# Altium schematic sheet Sheet2.SchDoc: TERMINATION RESISTORS
size B; DocumentNumber: 2; SheetNumber: 2; SheetTotal: 5
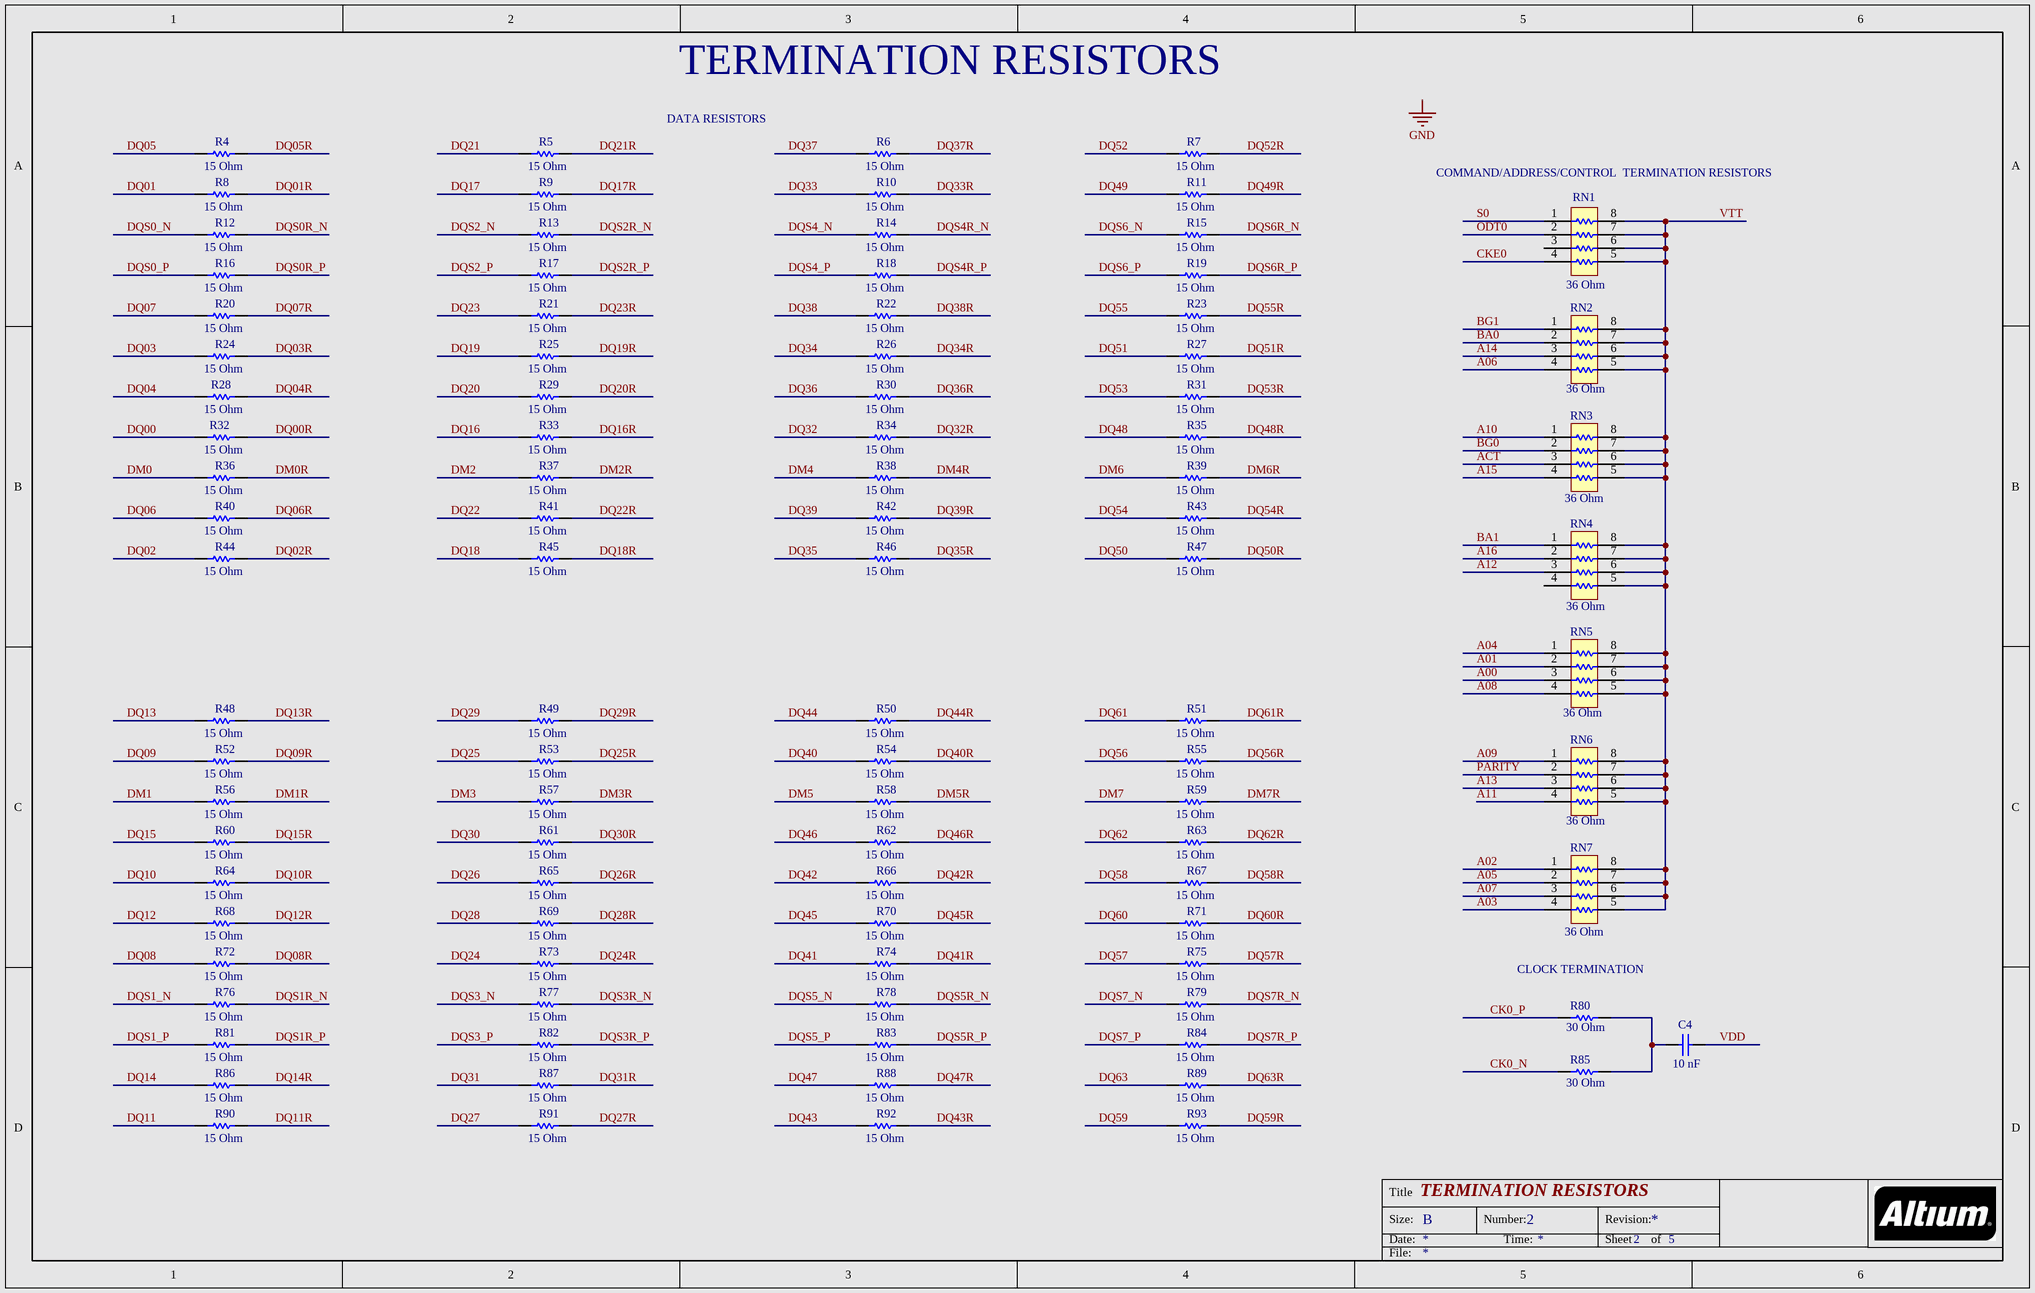
[diagram p0: Sheet2.SchDoc]

## Parts
C4  Capacitance: 10 nF  [CAPC1005X55X10NL05]  (hidden comment: C1005X7R1E103M050BB)
R4  Resistance: 15 Ohm  [RESC0603X26X15ML03T05]  (hidden comment: ERJ-1GEJ150C)
R5  Resistance: 15 Ohm  [RESC0603X26X15ML03T05]  (hidden comment: ERJ-1GEJ150C)
R6  Resistance: 15 Ohm  [RESC0603X26X15ML03T05]  (hidden comment: ERJ-1GEJ150C)
R7  Resistance: 15 Ohm  [RESC0603X26X15ML03T05]  (hidden comment: ERJ-1GEJ150C)
R8  Resistance: 15 Ohm  [RESC0603X26X15ML03T05]  (hidden comment: ERJ-1GEJ150C)
R9  Resistance: 15 Ohm  [RESC0603X26X15ML03T05]  (hidden comment: ERJ-1GEJ150C)
R10  Resistance: 15 Ohm  [RESC0603X26X15ML03T05]  (hidden comment: ERJ-1GEJ150C)
R11  Resistance: 15 Ohm  [RESC0603X26X15ML03T05]  (hidden comment: ERJ-1GEJ150C)
R12  Resistance: 15 Ohm  [RESC0603X26X15ML03T05]  (hidden comment: ERJ-1GEJ150C)
R13  Resistance: 15 Ohm  [RESC0603X26X15ML03T05]  (hidden comment: ERJ-1GEJ150C)
R14  Resistance: 15 Ohm  [RESC0603X26X15ML03T05]  (hidden comment: ERJ-1GEJ150C)
R15  Resistance: 15 Ohm  [RESC0603X26X15ML03T05]  (hidden comment: ERJ-1GEJ150C)
R16  Resistance: 15 Ohm  [RESC0603X26X15ML03T05]  (hidden comment: ERJ-1GEJ150C)
R17  Resistance: 15 Ohm  [RESC0603X26X15ML03T05]  (hidden comment: ERJ-1GEJ150C)
R18  Resistance: 15 Ohm  [RESC0603X26X15ML03T05]  (hidden comment: ERJ-1GEJ150C)
R19  Resistance: 15 Ohm  [RESC0603X26X15ML03T05]  (hidden comment: ERJ-1GEJ150C)
R20  Resistance: 15 Ohm  [RESC0603X26X15ML03T05]  (hidden comment: ERJ-1GEJ150C)
R21  Resistance: 15 Ohm  [RESC0603X26X15ML03T05]  (hidden comment: ERJ-1GEJ150C)
R22  Resistance: 15 Ohm  [RESC0603X26X15ML03T05]  (hidden comment: ERJ-1GEJ150C)
R23  Resistance: 15 Ohm  [RESC0603X26X15ML03T05]  (hidden comment: ERJ-1GEJ150C)
R24  Resistance: 15 Ohm  [RESC0603X26X15ML03T05]  (hidden comment: ERJ-1GEJ150C)
R25  Resistance: 15 Ohm  [RESC0603X26X15ML03T05]  (hidden comment: ERJ-1GEJ150C)
R26  Resistance: 15 Ohm  [RESC0603X26X15ML03T05]  (hidden comment: ERJ-1GEJ150C)
R27  Resistance: 15 Ohm  [RESC0603X26X15ML03T05]  (hidden comment: ERJ-1GEJ150C)
R28  Resistance: 15 Ohm  [RESC0603X26X15ML03T05]  (hidden comment: ERJ-1GEJ150C)
R29  Resistance: 15 Ohm  [RESC0603X26X15ML03T05]  (hidden comment: ERJ-1GEJ150C)
R30  Resistance: 15 Ohm  [RESC0603X26X15ML03T05]  (hidden comment: ERJ-1GEJ150C)
R31  Resistance: 15 Ohm  [RESC0603X26X15ML03T05]  (hidden comment: ERJ-1GEJ150C)
R32  Resistance: 15 Ohm  [RESC0603X26X15ML03T05]  (hidden comment: ERJ-1GEJ150C)
R33  Resistance: 15 Ohm  [RESC0603X26X15ML03T05]  (hidden comment: ERJ-1GEJ150C)
R34  Resistance: 15 Ohm  [RESC0603X26X15ML03T05]  (hidden comment: ERJ-1GEJ150C)
R35  Resistance: 15 Ohm  [RESC0603X26X15ML03T05]  (hidden comment: ERJ-1GEJ150C)
R36  Resistance: 15 Ohm  [RESC0603X26X15ML03T05]  (hidden comment: ERJ-1GEJ150C)
R37  Resistance: 15 Ohm  [RESC0603X26X15ML03T05]  (hidden comment: ERJ-1GEJ150C)
R38  Resistance: 15 Ohm  [RESC0603X26X15ML03T05]  (hidden comment: ERJ-1GEJ150C)
R39  Resistance: 15 Ohm  [RESC0603X26X15ML03T05]  (hidden comment: ERJ-1GEJ150C)
R40  Resistance: 15 Ohm  [RESC0603X26X15ML03T05]  (hidden comment: ERJ-1GEJ150C)
R41  Resistance: 15 Ohm  [RESC0603X26X15ML03T05]  (hidden comment: ERJ-1GEJ150C)
R42  Resistance: 15 Ohm  [RESC0603X26X15ML03T05]  (hidden comment: ERJ-1GEJ150C)
R43  Resistance: 15 Ohm  [RESC0603X26X15ML03T05]  (hidden comment: ERJ-1GEJ150C)
R44  Resistance: 15 Ohm  [RESC0603X26X15ML03T05]  (hidden comment: ERJ-1GEJ150C)
R45  Resistance: 15 Ohm  [RESC0603X26X15ML03T05]  (hidden comment: ERJ-1GEJ150C)
R46  Resistance: 15 Ohm  [RESC0603X26X15ML03T05]  (hidden comment: ERJ-1GEJ150C)
R47  Resistance: 15 Ohm  [RESC0603X26X15ML03T05]  (hidden comment: ERJ-1GEJ150C)
R48  Resistance: 15 Ohm  [RESC0603X26X15ML03T05]  (hidden comment: ERJ-1GEJ150C)
R49  Resistance: 15 Ohm  [RESC0603X26X15ML03T05]  (hidden comment: ERJ-1GEJ150C)
R50  Resistance: 15 Ohm  [RESC0603X26X15ML03T05]  (hidden comment: ERJ-1GEJ150C)
R51  Resistance: 15 Ohm  [RESC0603X26X15ML03T05]  (hidden comment: ERJ-1GEJ150C)
R52  Resistance: 15 Ohm  [RESC0603X26X15ML03T05]  (hidden comment: ERJ-1GEJ150C)
R53  Resistance: 15 Ohm  [RESC0603X26X15ML03T05]  (hidden comment: ERJ-1GEJ150C)
R54  Resistance: 15 Ohm  [RESC0603X26X15ML03T05]  (hidden comment: ERJ-1GEJ150C)
R55  Resistance: 15 Ohm  [RESC0603X26X15ML03T05]  (hidden comment: ERJ-1GEJ150C)
R56  Resistance: 15 Ohm  [RESC0603X26X15ML03T05]  (hidden comment: ERJ-1GEJ150C)
R57  Resistance: 15 Ohm  [RESC0603X26X15ML03T05]  (hidden comment: ERJ-1GEJ150C)
R58  Resistance: 15 Ohm  [RESC0603X26X15ML03T05]  (hidden comment: ERJ-1GEJ150C)
R59  Resistance: 15 Ohm  [RESC0603X26X15ML03T05]  (hidden comment: ERJ-1GEJ150C)
R60  Resistance: 15 Ohm  [RESC0603X26X15ML03T05]  (hidden comment: ERJ-1GEJ150C)
R61  Resistance: 15 Ohm  [RESC0603X26X15ML03T05]  (hidden comment: ERJ-1GEJ150C)
R62  Resistance: 15 Ohm  [RESC0603X26X15ML03T05]  (hidden comment: ERJ-1GEJ150C)
R63  Resistance: 15 Ohm  [RESC0603X26X15ML03T05]  (hidden comment: ERJ-1GEJ150C)
R64  Resistance: 15 Ohm  [RESC0603X26X15ML03T05]  (hidden comment: ERJ-1GEJ150C)
R65  Resistance: 15 Ohm  [RESC0603X26X15ML03T05]  (hidden comment: ERJ-1GEJ150C)
R66  Resistance: 15 Ohm  [RESC0603X26X15ML03T05]  (hidden comment: ERJ-1GEJ150C)
R67  Resistance: 15 Ohm  [RESC0603X26X15ML03T05]  (hidden comment: ERJ-1GEJ150C)
R68  Resistance: 15 Ohm  [RESC0603X26X15ML03T05]  (hidden comment: ERJ-1GEJ150C)
R69  Resistance: 15 Ohm  [RESC0603X26X15ML03T05]  (hidden comment: ERJ-1GEJ150C)
R70  Resistance: 15 Ohm  [RESC0603X26X15ML03T05]  (hidden comment: ERJ-1GEJ150C)
R71  Resistance: 15 Ohm  [RESC0603X26X15ML03T05]  (hidden comment: ERJ-1GEJ150C)
R72  Resistance: 15 Ohm  [RESC0603X26X15ML03T05]  (hidden comment: ERJ-1GEJ150C)
R73  Resistance: 15 Ohm  [RESC0603X26X15ML03T05]  (hidden comment: ERJ-1GEJ150C)
R74  Resistance: 15 Ohm  [RESC0603X26X15ML03T05]  (hidden comment: ERJ-1GEJ150C)
R75  Resistance: 15 Ohm  [RESC0603X26X15ML03T05]  (hidden comment: ERJ-1GEJ150C)
R76  Resistance: 15 Ohm  [RESC0603X26X15ML03T05]  (hidden comment: ERJ-1GEJ150C)
R77  Resistance: 15 Ohm  [RESC0603X26X15ML03T05]  (hidden comment: ERJ-1GEJ150C)
R78  Resistance: 15 Ohm  [RESC0603X26X15ML03T05]  (hidden comment: ERJ-1GEJ150C)
R79  Resistance: 15 Ohm  [RESC0603X26X15ML03T05]  (hidden comment: ERJ-1GEJ150C)
R80  Resistance: 30 Ohm  [RESC1005X40X25NL5T10]  (hidden comment: RC0402JR-0730RL)
R81  Resistance: 15 Ohm  [RESC0603X26X15ML03T05]  (hidden comment: ERJ-1GEJ150C)
R82  Resistance: 15 Ohm  [RESC0603X26X15ML03T05]  (hidden comment: ERJ-1GEJ150C)
R83  Resistance: 15 Ohm  [RESC0603X26X15ML03T05]  (hidden comment: ERJ-1GEJ150C)
R84  Resistance: 15 Ohm  [RESC0603X26X15ML03T05]  (hidden comment: ERJ-1GEJ150C)
R85  Resistance: 30 Ohm  [RESC1005X40X25NL5T10]  (hidden comment: RC0402JR-0730RL)
R86  Resistance: 15 Ohm  [RESC0603X26X15ML03T05]  (hidden comment: ERJ-1GEJ150C)
R87  Resistance: 15 Ohm  [RESC0603X26X15ML03T05]  (hidden comment: ERJ-1GEJ150C)
R88  Resistance: 15 Ohm  [RESC0603X26X15ML03T05]  (hidden comment: ERJ-1GEJ150C)
R89  Resistance: 15 Ohm  [RESC0603X26X15ML03T05]  (hidden comment: ERJ-1GEJ150C)
R90  Resistance: 15 Ohm  [RESC0603X26X15ML03T05]  (hidden comment: ERJ-1GEJ150C)
R91  Resistance: 15 Ohm  [RESC0603X26X15ML03T05]  (hidden comment: ERJ-1GEJ150C)
R92  Resistance: 15 Ohm  [RESC0603X26X15ML03T05]  (hidden comment: ERJ-1GEJ150C)
R93  Resistance: 15 Ohm  [RESC0603X26X15ML03T05]  (hidden comment: ERJ-1GEJ150C)
RN1  Resistance: 36 Ohm  [BOUR-CAY10-J4_V]  (hidden comment: CAY10-360J4LF)
RN2  Resistance: 36 Ohm  [BOUR-CAY10-J4_V]  (hidden comment: CAY10-360J4LF)
RN3  Resistance: 36 Ohm  [BOUR-CAY10-J4_V]  (hidden comment: CAY10-360J4LF)
RN4  Resistance: 36 Ohm  [BOUR-CAY10-J4_V]  (hidden comment: CAY10-360J4LF)
RN5  Resistance: 36 Ohm  [BOUR-CAY10-J4_V]  (hidden comment: CAY10-360J4LF)
RN6  Resistance: 36 Ohm  [BOUR-CAY10-J4_V]  (hidden comment: CAY10-360J4LF)
RN7  Resistance: 36 Ohm  [BOUR-CAY10-J4_V]  (hidden comment: CAY10-360J4LF)

## Nets
A00: RN5.3
A01: RN5.2
A02: RN7.1
A03: RN7.4
A04: RN5.1
A05: RN7.2
A06: RN2.4
A07: RN7.3
A08: RN5.4
A09: RN6.1
A10: RN3.1
A11: RN6.4
A12: RN4.3
A13: RN6.3
A14: RN2.3
A15: RN3.4
A16: RN4.2
ACT: RN3.3
BA0: RN2.2
BA1: RN4.1
BG0: RN3.2
BG1: RN2.1
CK0_N: R85.1
CK0_P: R80.1
CKE0: RN1.4
DM0: R36.1
DM0R: R36.2
DM1: R56.1
DM1R: R56.2
DM2: R37.1
DM2R: R37.2
DM3: R57.1
DM3R: R57.2
DM4: R38.1
DM4R: R38.2
DM5: R58.1
DM5R: R58.2
DM6: R39.1
DM6R: R39.2
DM7: R59.1
DM7R: R59.2
DQ00: R32.1
DQ00R: R32.2
DQ01: R8.1
DQ01R: R8.2
DQ02: R44.1
DQ02R: R44.2
DQ03: R24.1
DQ03R: R24.2
DQ04: R28.1
DQ04R: R28.2
DQ05: R4.1
DQ05R: R4.2
DQ06: R40.1
DQ06R: R40.2
DQ07: R20.1
DQ07R: R20.2
DQ08: R72.1
DQ08R: R72.2
DQ09: R52.1
DQ09R: R52.2
DQ10: R64.1
DQ10R: R64.2
DQ11: R90.1
DQ11R: R90.2
DQ12: R68.1
DQ12R: R68.2
DQ13: R48.1
DQ13R: R48.2
DQ14: R86.1
DQ14R: R86.2
DQ15: R60.1
DQ15R: R60.2
DQ16: R33.1
DQ16R: R33.2
DQ17: R9.1
DQ17R: R9.2
DQ18: R45.1
DQ18R: R45.2
DQ19: R25.1
DQ19R: R25.2
DQ20: R29.1
DQ20R: R29.2
DQ21: R5.1
DQ21R: R5.2
DQ22: R41.1
DQ22R: R41.2
DQ23: R21.1
DQ23R: R21.2
DQ24: R73.1
DQ24R: R73.2
DQ25: R53.1
DQ25R: R53.2
DQ26: R65.1
DQ26R: R65.2
DQ27: R91.1
DQ27R: R91.2
DQ28: R69.1
DQ28R: R69.2
DQ29: R49.1
DQ29R: R49.2
DQ30: R61.1
DQ30R: R61.2
DQ31: R87.1
DQ31R: R87.2
DQ32: R34.1
DQ32R: R34.2
DQ33: R10.1
DQ33R: R10.2
DQ34: R26.1
DQ34R: R26.2
DQ35: R46.1
DQ35R: R46.2
DQ36: R30.1
DQ36R: R30.2
DQ37: R6.1
DQ37R: R6.2
DQ38: R22.1
DQ38R: R22.2
DQ39: R42.1
DQ39R: R42.2
DQ40: R54.1
DQ40R: R54.2
DQ41: R74.1
DQ41R: R74.2
DQ42: R66.1
DQ42R: R66.2
DQ43: R92.1
DQ43R: R92.2
DQ44: R50.1
DQ44R: R50.2
DQ45: R70.1
DQ45R: R70.2
DQ46: R62.1
DQ46R: R62.2
DQ47: R88.1
DQ47R: R88.2
DQ48: R35.1
DQ48R: R35.2
DQ49: R11.1
DQ49R: R11.2
DQ50: R47.1
DQ50R: R47.2
DQ51: R27.1
DQ51R: R27.2
DQ52: R7.1
DQ52R: R7.2
DQ53: R31.1
DQ53R: R31.2
DQ54: R43.1
DQ54R: R43.2
DQ55: R23.1
DQ55R: R23.2
DQ56: R55.1
DQ56R: R55.2
DQ57: R75.1
DQ57R: R75.2
DQ58: R67.1
DQ58R: R67.2
DQ59: R93.1
DQ59R: R93.2
DQ60: R71.1
DQ60R: R71.2
DQ61: R51.1
DQ61R: R51.2
DQ62: R63.1
DQ62R: R63.2
DQ63: R89.1
DQ63R: R89.2
DQS0_N: R12.1
DQS0_P: R16.1
DQS0R_N: R12.2
DQS0R_P: R16.2
DQS1_N: R76.1
DQS1_P: R81.1
DQS1R_N: R76.2
DQS1R_P: R81.2
DQS2_N: R13.1
DQS2_P: R17.1
DQS2R_N: R13.2
DQS2R_P: R17.2
DQS3_N: R77.1
DQS3_P: R82.1
DQS3R_N: R77.2
DQS3R_P: R82.2
DQS4_N: R14.1
DQS4_P: R18.1
DQS4R_N: R14.2
DQS4R_P: R18.2
DQS5_N: R78.1
DQS5_P: R83.1
DQS5R_N: R78.2
DQS5R_P: R83.2
DQS6_N: R15.1
DQS6_P: R19.1
DQS6R_N: R15.2
DQS6R_P: R19.2
DQS7_N: R79.1
DQS7_P: R84.1
DQS7R_N: R79.2
DQS7R_P: R84.2
ODT0: RN1.2
PARITY: RN6.2
S0: RN1.1
VDD: C4.2
VTT: RN1.5 RN1.6 RN1.7 RN1.8 RN2.5 RN2.6 RN2.7 RN2.8 RN3.5 RN3.6 RN3.7 RN3.8 RN4.5 RN4.6 RN4.7 RN4.8 RN5.5 RN5.6 RN5.7 RN5.8 RN6.5 RN6.6 RN6.7 RN6.8 RN7.5 RN7.6 RN7.7 RN7.8
NetC4_1: C4.1 R80.2 R85.2

Not connected (* = marked no-connect by the designer): RN1 3; RN4 4

## Notes on the sheet
- DATA RESISTORS
- (near RN1) COMMAND/ADDRESS/CONTROL  TERMINATION RESISTORS
- CLOCK TERMINATION
- Labels drawn without touching a wire or pin: GND
- Title
- Size:
- Date:
- B
- Number:
- Time:
- Revision:
- Sheet
- of
- File:

## Library data of the parts
C4 = CMP-1663-00012-1: Chip Capacitor, 10 nF, +/- 15%, 25 V, -55 to 125 degC, 0402 (1005 Metric), RoHS, Tape and Reel; Voltage Rating: 25 V; Type (Capacitors): X7R; Tolerance: 20%; Width: 0.5 mm; ComponentLink2Description: Datasheet; Max Operating Temperature: 125 degC; PartNumber: C1005X7R1E103M050BB; Mounting Technology: Surface Mount; Case Code (Metric): 1005; ComponentLink1Description: Manufacturer URL; Case Code (Imperial): 0402; PackageDescription: 2-Pin Surface Mount Device, Body 1 x 0.5 mm; ComponentLink1URL: http://www.tdk.com/; Mount: Surface Mount; Package Quantity: 10000; ComponentLink2URL: https://ciiva.com/datasheet-click-20389836?src=ciiva&sig=78734acc; Voltage Rating (DC): 25 V; Length: 1 mm; DatasheetVersion: 03/2015; Height: 0.5 mm; RoHSCompliant: true; Case/Package: 0402; Packaging: Tape and Reel; Min Operating Temperature: -55 degC
R4-R79 R81-R84 R86-R93 = CMP-2004-03155-3: Chip Resistor, 15 Ohm, +/- 5%, 0.05 W, -55 to 125 degC, 0201 (0603 Metric), RoHS, Tape and Reel; Voltage Rating: 25 V; Power Rating: 50 mW; PackageDescription: 2-Pin Surface Mount Device, Body 0.6 x 0.3 mm; Width: 0.3 mm; Length: 0.6 mm; Height: 0.23 mm; Packaging: Tape and Reel; Case Code (Metric): 0603; RoHSCompliant: true; Case/Package: 0201; ComponentLink2Description: Datasheet; Package Quantity: 15000; Max Operating Temperature: 125 degC; Tolerance: 5%; ComponentLink1URL: http://www.panasonic.com/; Min Operating Temperature: -55 degC; PartNumber: ERJ-1GEJ150C; ComponentLink1Description: Manufacturer URL; ComponentLink2URL: http://media.digikey.com/pdf/Data%20Sheets/Panasonic%20Resistors%20Thermistors%20PDFs/ERJ%205%25.pdf; DatasheetVersion: 03/2005; Case Code (Imperial): 0201; Mounting Technology: Surface Mount
R80 R85 = CMP-2002-07983-2: Chip Resistor, 30 Ohm, +/- 5%, 0.063 W, -55 to 155 degC, 0402 (1005 Metric), RoHS, Tape and Reel; Voltage Rating: 50 V; Power Rating: 63 mW; Case/Package: 0402; ComponentLink2URL: http://www.yageo.com/documents/recent/PYu-RC_Group_51_RoHS_L_04.pdf; Height: 0.35 mm; RoHSCompliant: true; Case Code (Imperial): 0402; ComponentLink1URL: http://www.yageo.com/; Width: 0.5 mm; Tolerance: 5%; Max Operating Temperature: 155 degC; PackageDescription: 2-Pin Surface Mount Device, Body 1 x 0.5 mm; Radiation Hardening: No; Min Operating Temperature: -55 degC; PartNumber: RC0402JR-0730RL; Packaging: Tape and Reel; ComponentLink2Description: Datasheet; Length: 1 mm; Package Quantity: 10000; Case Code (Metric): 1005; ComponentLink1Description: Manufacturer URL; DatasheetVersion: Rev. 4, 02/2016; Mounting Technology: Surface Mount; Mount: Surface Mount
RN1-RN7 = CMP-1734-00001-1: Chip Resistor Array, 36 Ohm, +/- 5%, 62.5 mW, -55 to 125 degC, 8-Pin SMD, RoHS, Tape and Reel; Power Rating: 120 mW; Type (Resistor): Thick Film; ComponentLink1URL: http://www.bourns.com/; ComponentLink2Description: Datasheet; Height: 0.018 inch; Mounting Technology: Surface Mount; ComponentLink2URL: http://www.bourns.com/docs/Product-Datasheets/CAY10.pdf; PartNumber: CAY10-360J4LF; Case Code (Metric): 2010; ComponentLink1Description: Manufacturer URL; DatasheetVersion: 01/2015; Width: 0.039 inch; Packaging: Tape and Reel; Pins: 8; RoHSCompliant: true; Mount: Surface Mount; Package Quantity: 10000; Length: 0.079 inch; PackageDescription: 8-Pin Surface Mount Device, Body 2 x 1 mm, Pitch 0.5 mm; Max Operating Temperature: 125 degC; Min Operating Temperature: -55 degC; Case/Package: 0804; Tolerance: 5%